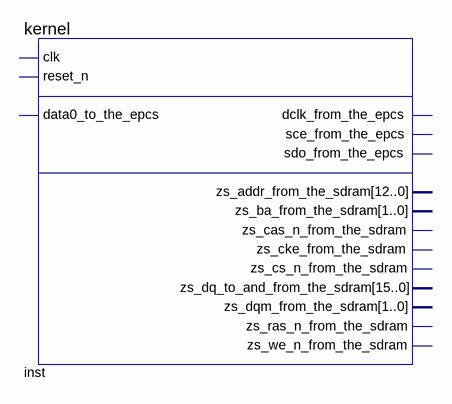
[diagram p0: schematic sheet]
// Quartus schematic HELLO.bdf as structural Verilog: 1 symbols, 0 pins
module HELLO (
);

  kernel inst ();  // open: clk, reset_n, data0_to_the_epcs, dclk_from_the_epcs, sce_from_the_epcs, sdo_from_the_epcs, zs_addr_from_the_sdram, zs_ba_from_the_sdram, zs_cas_n_from_the_sdram, zs_cke_from_the_sdram, zs_cs_n_from_the_sdram, zs_dqm_from_the_sdram, zs_ras_n_from_the_sdram, zs_we_n_from_the_sdram, zs_dq_to_and_from_the_sdram
endmodule
